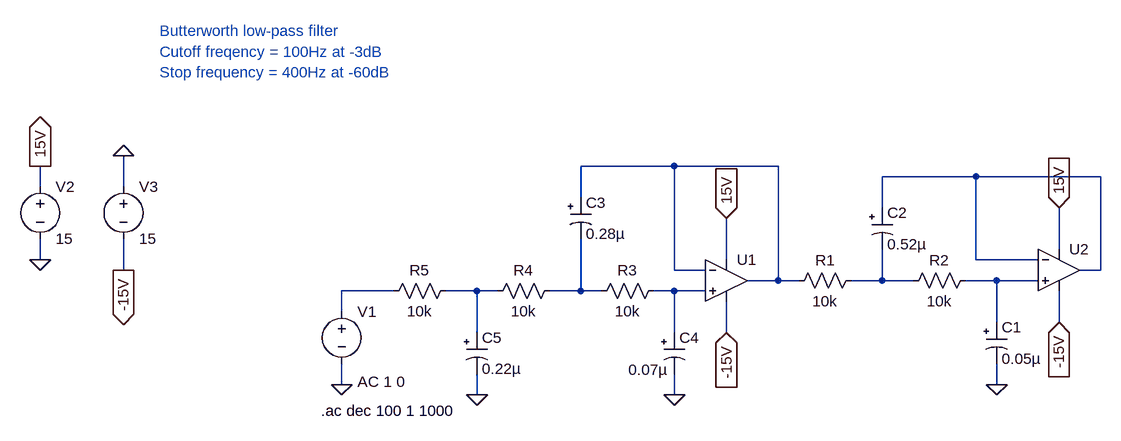
[diagram p0: schematic Filters - Active Low Pass Filter - 5th order 2 stages.asc]
Filters - Active Low Pass Filter - 5th order 2 stages.asc, the LTspice schematic file:
Version 4.1
SHEET 1 880 680
WIRE -80 -160 -224 -160
WIRE 80 -160 -80 -160
WIRE 384 -144 240 -144
WIRE 576 -144 384 -144
WIRE -1056 -128 -1056 -160
WIRE -928 -128 -928 -176
WIRE -224 -112 -224 -160
WIRE 240 -96 240 -144
WIRE 512 -32 512 -96
WIRE -1056 -16 -1056 -48
WIRE 0 -16 0 -80
WIRE 384 -16 384 -144
WIRE 480 -16 384 -16
WIRE -928 0 -928 -48
WIRE -80 0 -80 -160
WIRE -32 0 -80 0
WIRE 576 0 576 -144
WIRE 576 0 544 0
WIRE 80 16 80 -160
WIRE 80 16 32 16
WIRE 112 16 80 16
WIRE 240 16 240 -32
WIRE 240 16 192 16
WIRE 288 16 240 16
WIRE 416 16 368 16
WIRE 480 16 416 16
WIRE -512 32 -592 32
WIRE -384 32 -432 32
WIRE -352 32 -384 32
WIRE -224 32 -224 -48
WIRE -224 32 -272 32
WIRE -192 32 -224 32
WIRE -80 32 -112 32
WIRE -32 32 -80 32
WIRE -592 64 -592 32
WIRE 416 80 416 16
WIRE 512 80 512 32
WIRE -384 96 -384 32
WIRE -80 96 -80 32
WIRE 0 96 0 48
WIRE -592 176 -592 144
WIRE 416 176 416 144
WIRE -384 192 -384 160
WIRE -80 192 -80 160
FLAG -384 192 0
FLAG -80 192 0
FLAG 416 176 0
FLAG -592 176 0
FLAG -1056 -16 0
FLAG -1056 -160 15V
IOPIN -1056 -160 Out
FLAG -928 0 -15V
IOPIN -928 0 Out
FLAG -928 -176 0
FLAG 0 -80 15V
IOPIN 0 -80 In
FLAG 512 -96 15V
IOPIN 512 -96 In
FLAG 512 80 -15V
IOPIN 512 80 In
FLAG 0 96 -15V
IOPIN 0 96 In
SYMBOL OpAmps\\UniversalOpAmp2 0 16 R0
SYMATTR InstName U1
SYMBOL OpAmps\\UniversalOpAmp2 512 0 R0
SYMATTR InstName U2
SYMBOL res 208 0 R90
WINDOW 0 0 56 VBottom 2
WINDOW 3 32 56 VTop 2
SYMATTR InstName R1
SYMATTR Value 10k
SYMBOL res 384 0 R90
WINDOW 0 0 56 VBottom 2
WINDOW 3 32 56 VTop 2
SYMATTR InstName R2
SYMATTR Value 10k
SYMBOL polcap 400 80 R0
SYMATTR InstName C1
SYMATTR Value 0.05µ
SYMBOL polcap 224 -96 R0
SYMATTR InstName C2
SYMATTR Value 0.52µ
SYMBOL polcap -240 -112 R0
SYMATTR InstName C3
SYMATTR Value 0.28µ
SYMBOL polcap -96 96 R0
WINDOW 3 -55 57 Left 2
SYMATTR InstName C4
SYMATTR Value 0.07µ
SYMBOL polcap -400 96 R0
SYMATTR InstName C5
SYMATTR Value 0.22µ
SYMBOL res -96 16 R90
WINDOW 0 0 56 VBottom 2
WINDOW 3 32 56 VTop 2
SYMATTR InstName R3
SYMATTR Value 10k
SYMBOL res -256 16 R90
WINDOW 0 0 56 VBottom 2
WINDOW 3 32 56 VTop 2
SYMATTR InstName R4
SYMATTR Value 10k
SYMBOL res -416 16 R90
WINDOW 0 0 56 VBottom 2
WINDOW 3 32 56 VTop 2
SYMATTR InstName R5
SYMATTR Value 10k
SYMBOL voltage -592 48 R0
WINDOW 123 24 124 Left 2
WINDOW 39 0 0 Left 0
SYMATTR InstName V1
SYMATTR Value ""
SYMATTR Value2 AC 1 0
SYMBOL voltage -1056 -144 R0
WINDOW 123 0 0 Left 0
WINDOW 39 0 0 Left 0
SYMATTR InstName V2
SYMATTR Value 15
SYMBOL voltage -928 -144 R0
WINDOW 123 0 0 Left 0
WINDOW 39 0 0 Left 0
SYMATTR InstName V3
SYMATTR Value 15
TEXT -624 216 Left 2 !.ac dec 100 1 1000
TEXT -872 -336 Left 2 ;Cutoff freqency = 100Hz at -3dB\nStop frequency = 400Hz at -60dB
TEXT -872 -368 Left 2 ;Butterworth low-pass filter

The netlist it stands for:
* Filters - Active Low Pass Filter - 5th order 2 stages.asc
X§U1 N008 N001 15V -15V N001 level2 Avol=1Meg GBW=10Meg Slew=10Meg Ilimit=25m Rail=0 Vos=0 En=0 Enk=0 In=0 Ink=0 Rin=500Meg  ; pins In+ In- V+ V- OUT
X§U2 N004 N002 15V -15V N002 level2 Avol=1Meg GBW=10Meg Slew=10Meg Ilimit=25m Rail=0 Vos=0 En=0 Enk=0 In=0 Ink=0 Rin=500Meg  ; pins In+ In- V+ V- OUT
R1 N003 N001 10k
R2 N004 N003 10k
C1 N004 0 0.05µ
C2 N002 N003 0.52µ
C3 N001 N007 0.28µ
C4 N008 0 0.07µ
C5 N006 0 0.22µ
R3 N008 N007 10k
R4 N007 N006 10k
R5 N006 N005 10k
V1 N005 0 AC 1 0
V2 15V 0 15
V3 0 -15V 15
.ac dec 100 1 1000
* Cutoff freqency = 100Hz at -3dB
* Stop frequency = 400Hz at -60dB
* Butterworth low-pass filter
.lib UniversalOpAmp2.lib
.backanno
.end